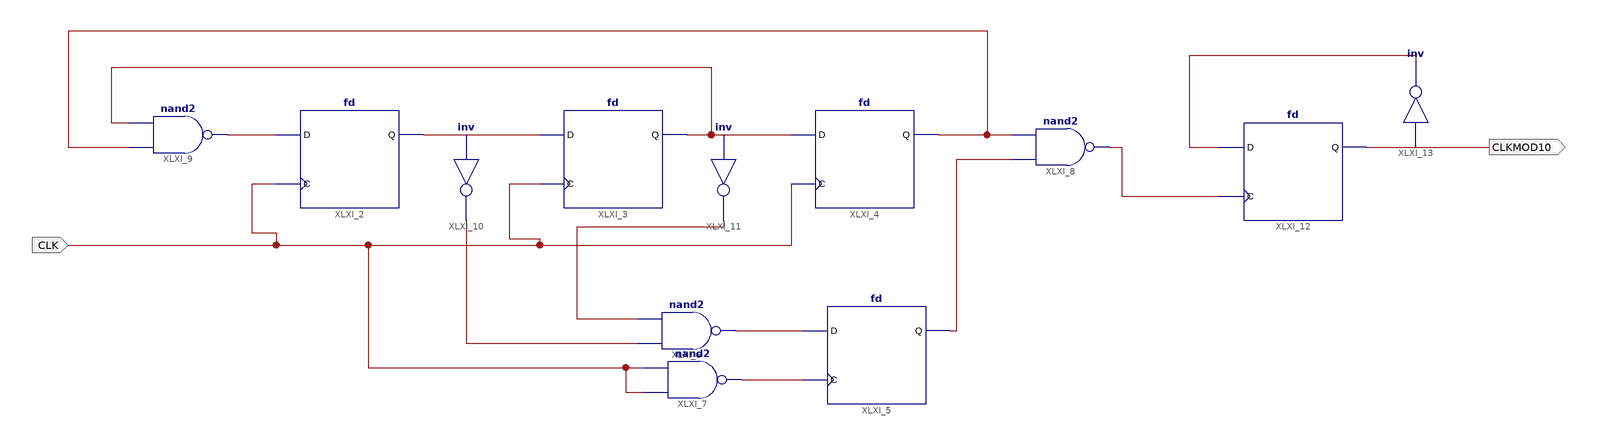
[diagram p0: schematic sheet 1]
// Xilinx ISE schematic mod10.sch (spartan6) as structural Verilog: 12 symbols, 2 ports
module mod10 (
  input  CLK,
  output CLKMOD10
);

  wire XLXN_1, XLXN_2, XLXN_3, XLXN_4, XLXN_6, XLXN_7, XLXN_8, XLXN_14, XLXN_15, XLXN_20, XLXN_22;

  fd XLXI_2 (.C(CLK), .D(XLXN_8), .Q(XLXN_1));
  fd XLXI_3 (.C(CLK), .D(XLXN_1), .Q(XLXN_2));
  fd XLXI_4 (.C(CLK), .D(XLXN_2), .Q(XLXN_3));
  fd XLXI_5 (.C(XLXN_7), .D(XLXN_6), .Q(XLXN_4));
  nand XLXI_6 (XLXN_6, XLXN_15, XLXN_14);
  nand XLXI_7 (XLXN_7, CLK, CLK);
  nand XLXI_8 (XLXN_20, XLXN_4, XLXN_3);
  nand XLXI_9 (XLXN_8, XLXN_3, XLXN_2);
  not XLXI_10 (XLXN_15, XLXN_1);
  not XLXI_11 (XLXN_14, XLXN_2);
  fd XLXI_12 (.C(XLXN_20), .D(XLXN_22), .Q(CLKMOD10));
  not XLXI_13 (XLXN_22, CLKMOD10);
endmodule
